# Altium schematic sheet output_buffer.SchDoc
size A; SheetNumber: 2; SheetTotal: 2
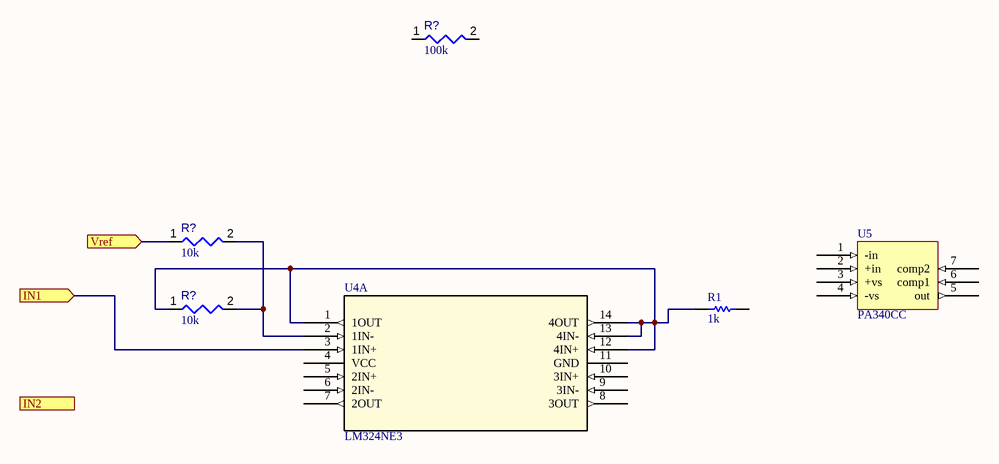
[diagram p0: output_buffer.SchDoc]

## Parts
(Parts that share a designator on the sheet are numbered #1, #2 ... from top to bottom, then left to right.)
R1  value 1k  [RESC2013X70X40ML20T20]  (hidden comment: Resistor 1k +/-1% 0805 125 mW)
R?#1  value 100k  [RESC2013X70X40ML20T20]  (hidden comment: Resistor 100k +/-1% 0805 125 mW)
R?#2  value 10k  [RESC2013X50X35ML15T15]  (hidden comment: Resistor 10k +/-1% 0805 125 mW)
R?#3  value 10k  [RESC2013X50X35ML15T15]  (hidden comment: Resistor 10k +/-1% 0805 125 mW)
U4  LM324NE3  [N14]  (part A of 2)
U5  PA340CC  [PA340CC-Footprint-1]

## Ports
IN1 (in), IN2 (in), Vref (in)

## Nets
IN1: U4.3(1IN+) ; port IN1
Vref: R?#2.1 ; port Vref
NetR1_1: R1.1 R?#3.1 U4.1(1OUT) U4.12(4IN+) U4.13(4IN-) U4.14(4OUT)
NetR?#2_2: R?#2.2 R?#3.2 U4.2(1IN-)

Not connected (* = marked no-connect by the designer): R1 2; R?#1 1 2; U4 4(VCC) 5(2IN+) 6(2IN-) 7(2OUT) 8(3OUT) 9(3IN-) 10(3IN+) 11(GND); U5 1(-in) 2(+in) 3(+vs) 4(-vs) 5(out) 6(comp1) 7(comp2)

## Library data of the parts
R1 = CMP-009-00010-4: Chip Resistor, 1 KOhm, +/- 1%, 0.125 W, -55 to 155 degC, 0805 (2013 Metric); Power: 125mW; Voltage Rating: 150V; Min Operating Temperature: -55°C; RoHS Compliant: True; Max Operating Temperature: 155°C; Case/Package: 0805; Pins: 2; Tolerance: 1%; Mounting Technology: SM
R?#1 = CMP-009-00024-4: Chip Resistor, 100 KOhm, +/- 1%, 0.125 W, -55 to 155 degC, 0805 (2012 Metric); Power: 125mW; Voltage Rating: 150V; Case/Package: 0805; Pins: 2; RoHS Compliant: True; Mounting Technology: SM; Tolerance: 1%; Max Operating Temperature: 155°C; Min Operating Temperature: -55°C
R?#2 R?#3 = CMP-009-00018-4: Chip Resistor, 10 KOhm, +/- 1%, 125 mW, -55 to 155 degC, 0805 (2012 Metric); Power: 125mW; Voltage Rating: 150V; RoHS Compliant: True; Mounting Technology: SM; Pins: 2; Case/Package: 0805; Min Operating Temperature: -55°C; Max Operating Temperature: 155°C; Tolerance: 1%
U4 = LM324NE3: No Description Available; Mfr_Name: Texas Instruments; Copyright: Copyright (C) 2022 Ultra Librarian. All rights reserved.; Manufacturer_Part_Number: LM324NE3; RefDes: RefDes; Type: DEV
U5 = CMP-014-00002-1